# Altium schematic sheet Electrode_Array_Hex_PCB.SchDoc
size A4; SheetNumber: 1; SheetTotal: 1
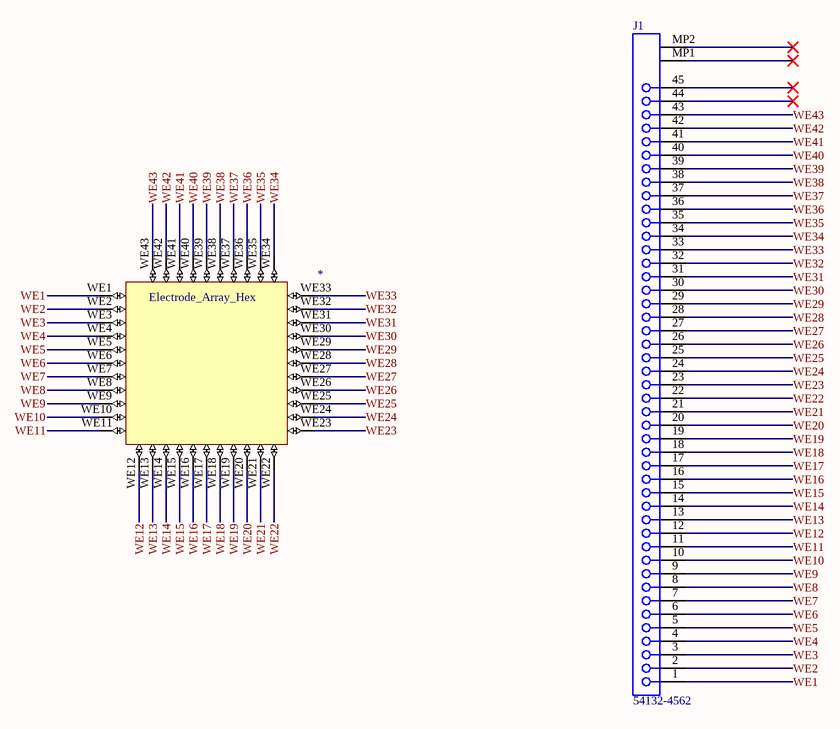
[diagram p0: Electrode_Array_Hex_PCB.SchDoc]

## Parts
*  Electrode_Array_Hex  [PCBComponent_1]
J1  54132-4562  [MOLX-54132-4562]

## Nets
WE1: *.WE1 J1.1
WE2: *.WE2 J1.2
WE3: *.WE3 J1.3
WE4: *.WE4 J1.4
WE5: *.WE5 J1.5
WE6: *.WE6 J1.6
WE7: *.WE7 J1.7
WE8: *.WE8 J1.8
WE9: *.WE9 J1.9
WE10: *.WE10 J1.10
WE11: *.WE11 J1.11
WE12: *.WE12 J1.12
WE13: *.WE13 J1.13
WE14: *.WE14 J1.14
WE15: *.WE15 J1.15
WE16: *.WE16 J1.16
WE17: *.WE17 J1.17
WE18: *.WE18 J1.18
WE19: *.WE19 J1.19
WE20: *.WE20 J1.20
WE21: *.WE21 J1.21
WE22: *.WE22 J1.22
WE23: *.WE23 J1.23
WE24: *.WE24 J1.24
WE25: *.WE25 J1.25
WE26: *.WE26 J1.26
WE27: *.WE27 J1.27
WE28: *.WE28 J1.28
WE29: *.WE29 J1.29
WE30: *.WE30 J1.30
WE31: *.WE31 J1.31
WE32: *.WE32 J1.32
WE33: *.WE33 J1.33
WE34: *.WE34 J1.34
WE35: *.WE35 J1.35
WE36: *.WE36 J1.36
WE37: *.WE37 J1.37
WE38: *.WE38 J1.38
WE39: *.WE39 J1.39
WE40: *.WE40 J1.40
WE41: *.WE41 J1.41
WE42: *.WE42 J1.42
WE43: *.WE43 J1.43

Not connected (* = marked no-connect by the designer): J1 44* 45* MP1* MP2*

## Library data of the parts
J1 = CMP-1241-00535-1: 0.5 mm Pitch Easy-On(TM) Type FPC Connector, 2.0 mm Mated Height, Right Angle, ZIF, SMT, Bottom Contact, 45 Circuits, -20 to 85 degC, ELV and RoHS Compliant, Tape and Reel; Manufacturer: Molex; PCB Retention: Yes; Material - Plating Termination: Gold; Mated Height: 2.00mm; Circuits (Loaded): 45; Stackable: No; Voltage (Max): 50V; Durability (mating cycles max): 20; Pitch - Mating Interface: 0.50mm; Current (Max per Contact): 0.5A; Entry Angle: 90degrees Angle; Material - Metal: Phosphor Bronze; ComponentLink1Description: Manufacturer URL; PackageVersion: Rev. F, 07/2010; ComponentLink3Description: Package Specification; Packing: Tape and Reel; PackageReference: 54132-4562; ComponentLink2Description: Datasheet; Material - Plating Mating: Gold; Contact Position: Bottom; PackageDescription: 45-Lead FPC Connector, Pitch 0.5 mm; ComponentLink1URL: http://www.molex.com/molex/index.jsp; Polarized to PCB: Yes; Mounting Technology: Surface Mount; RoHS: TRUE; PCB Locator: No; Number of Rows: 1; ComponentLink3URL: http://www.molex.com/pdm_docs/sd/541324562_sd.pdf; ComponentLink2URL: http://www.molex.com/webdocs/datasheets/pdf/en-us/0541324562_FFC_FPC_CONNECTORS.pdf; Orientation: Right Angle; PartNumber: 54132-4562